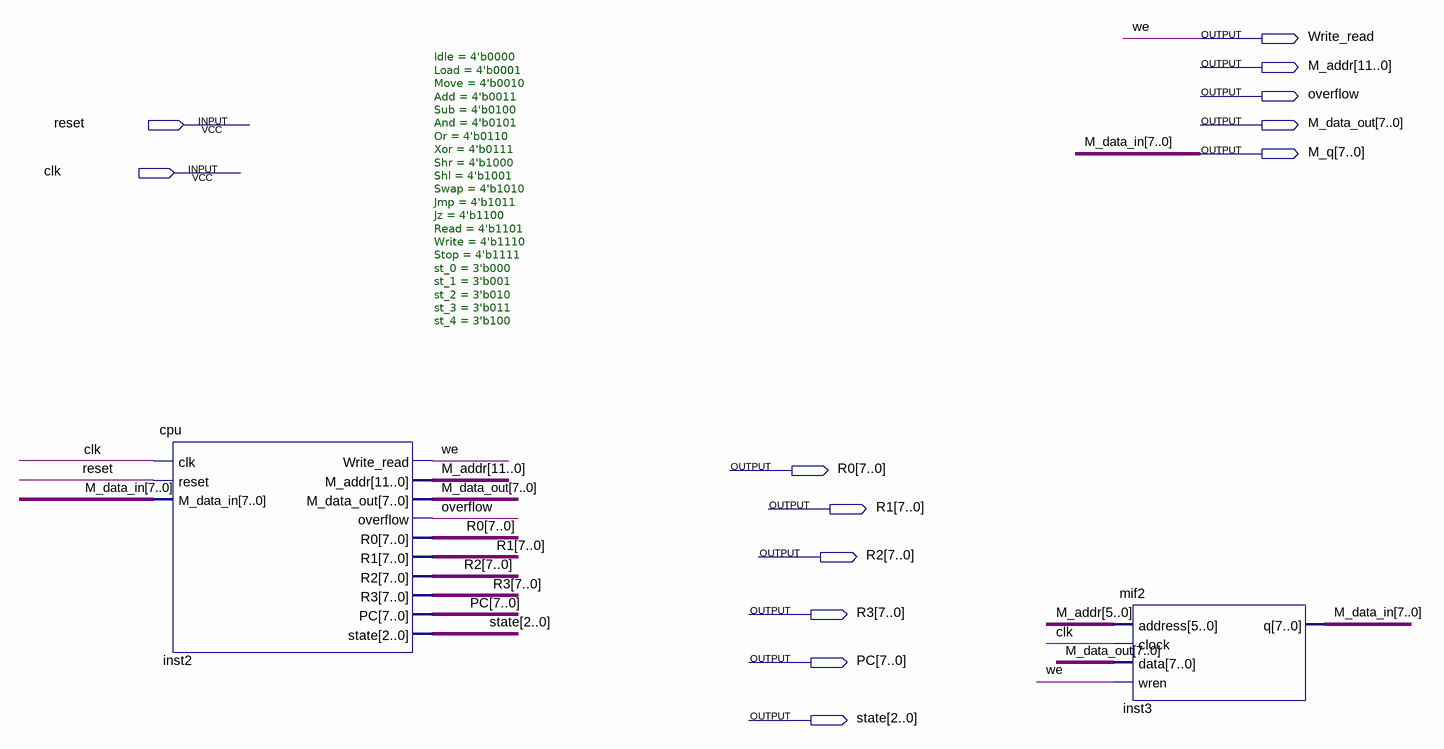
[diagram p0: schematic sheet]
// Quartus schematic computer.bdf as structural Verilog: 2 symbols, 13 pins
module computer (
  input  reset,
  input  clk,
  output Write_read,
  output [11:0] M_addr,
  output overflow,
  output [7:0] M_data_out,
  output [7:0] M_q,
  output [7:0] R0,
  output [7:0] R1,
  output [7:0] R2,
  output [7:0] R3,
  output [7:0] PC,
  output [2:0] state
);

  cpu #(.Idle(4'b0000), .Load(4'b0001), .Move(4'b0010), .Add(4'b0011), .Sub(4'b0100), .And(4'b0101), .Or(4'b0110), .Xor(4'b0111), .Shr(4'b1000), .Shl(4'b1001), .Swap(4'b1010), .Jmp(4'b1011), .Jz(4'b1100), .Read(4'b1101), .Write(4'b1110), .Stop(4'b1111), .st_0(3'b000), .st_1(3'b001), .st_2(3'b010), .st_3(3'b011), .st_4(3'b100)) inst2 (
    .clk(clk), .reset(reset), .M_data_in(M_q), .Write_read(Write_read), .M_addr(M_addr),
    .M_data_out(M_data_out), .overflow(overflow), .R0(R0), .R1(R1), .R2(R2), .R3(R3), .PC(PC), .state(state));
  mif2 inst3 (.address(M_addr[5:0]), .clock(clk), .data(M_data_out), .wren(Write_read), .q(M_q));

  // Other names for the same wires on the sheet: M_data_in[7:0] = M_q; we = Write_read
endmodule
